# EAGLE design FanDriver (EAGLE 7.1.0)
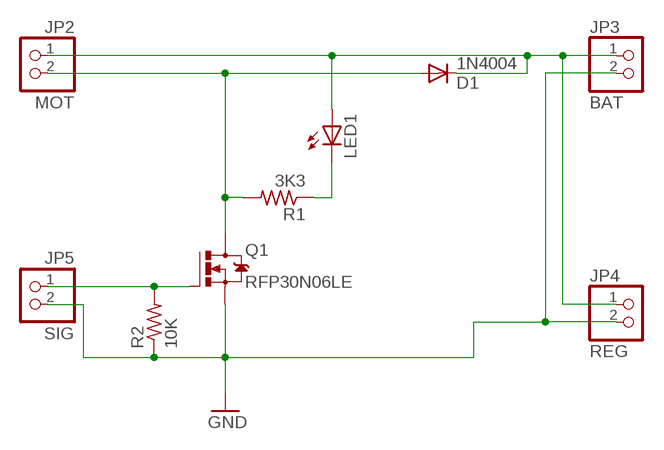
[diagram p0: schematic, sheet 1]

## Parts
D1  1N4004  [DO41-10]
JP2  MOT  PINHD-1X02_2.54-S  [1X02-S]
JP3  BAT  PINHD-1X02_2.54-S  [1X02-S]
JP4  REG  PINHD-1X02_2.54-S  [1X02-S]
JP5  SIG  PINHD-1X02_2.54-S  [1X02-S]
LED1  LEDCHIPLED_1206  [CHIPLED_1206]
Q1  RFP30N06LE  MOSFET-NBV  [TO220BV]
R1  3K3  R-US_R0603  [R0603]
R2  10K  R-US_R0603  [R0603]

## Nets
GND: JP3.2 JP4.2 JP5.2 Q1.S R2.1
M2: D1.A JP2.2 Q1.D R1.2
N$1: LED1.C R1.1
SIG: JP5.1 Q1.G R2.2
VBAT: D1.C JP2.1 JP3.1 JP4.1 LED1.A

## Library data of the parts
D1 = diode:1N4004: DIODE general purpose rectifier, 1 A
JP2-JP5 = pinhead-2:PINHD-1X02: PIN HEADER
LED1 = bt_opto:LED: LED Various packages
Q1 = ads4:MOSFET-N: N-Channel MOSFET
R1 R2 = rcl:R-US_: RESISTOR, American symbol

## Board
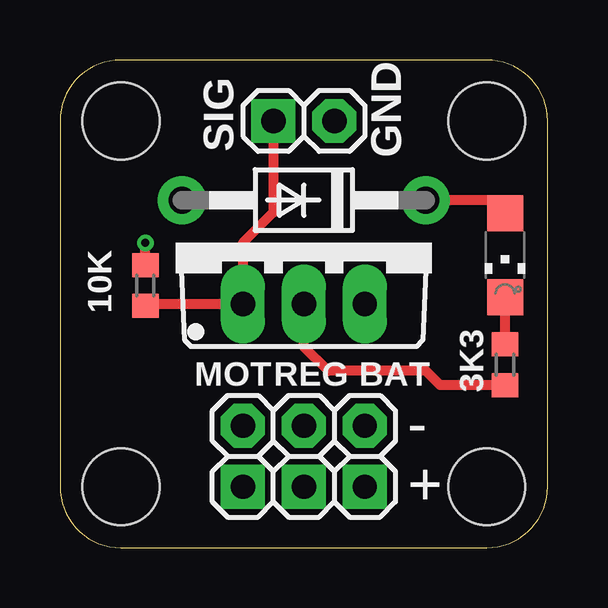
[diagram p1: board, top side]
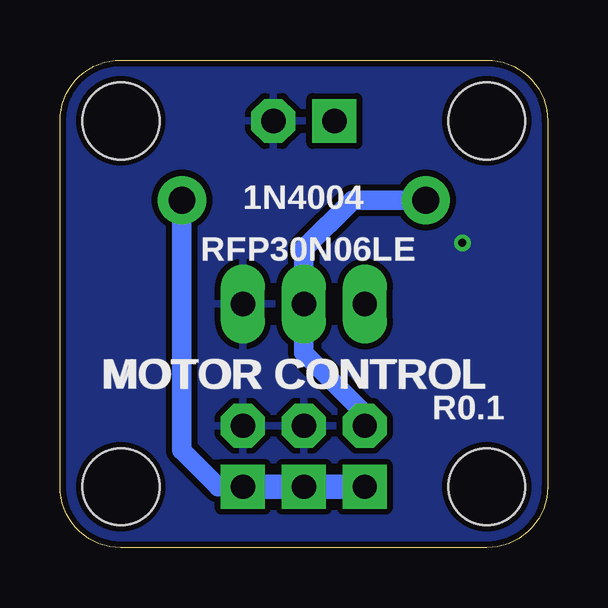
[diagram p2: board, bottom side, seen from below]

Size 20.32 x 20.32 mm. Coordinates in mm from the lower left corner, seen from the top.
Outline: 0,17.78 0,2.54 arc90 2.54,0 17.78,0 arc90 20.32,2.54 20.32,17.78 arc90 17.78,20.32 2.54,20.32 arc90 0,17.78
Copper layers (1*16): Top 0.0356mm / dielectric 1.5011mm / Bottom 0.0356mm
Design rules "LaenPCBOrder *": minimum track width 6mil, minimum drill 13mil, track to track 10mil, track to pad 10mil, pad to pad 10mil, via to via 10mil, smd to smd 8mil, copper to edge 10mil, drill to drill 10mil, minimum pad ring 7mil, minimum via ring 7mil, stop-mask expansion 3mil, vias tented up to drill 20mil, thermal gap 10mil
Holes 3.2 mm at 2.54,2.54 17.78,2.54 2.54,17.78 17.78,17.78

### Footprints (pad centres in the part's own frame; a part is rotated, then mirrored left to right if it is on the bottom)
DO41-10 = drill 1.118: A 5.08,0; C -5.08,0
1X02-S = drill 1.016 square: 1 -1.27,0 | drill 1.016 octagon: 2 1.27,0
CHIPLED_1206 = smd 1.5 x 1.5: A 0,-1.75; C 0,1.75
TO220BV = drill 1.016 long: D 0,0; G -2.54,0; S 2.54,0
R0603 = smd 1 x 1.1: 1 -0.85,0; 2 0.85,0

### Placement (x,y rotation side)
D1  10.16,14.48 180 top
JP2  7.62,3.81 90 top
JP3  12.7,3.81 90 top
JP4  10.16,3.81 90 top
JP5  10.16,17.78 0 top
LED1  18.54,12.19 180 top
Q1  10.16,10.16 0 top
R1  18.54,7.62 270 top
R2  3.56,10.92 270 top

### Tracks (layer width: path | path; a pad name or v marks a point on that pad's centre or on a via)
GND  (via drill 0.33)
  Top 0.406: R2.1 v3.56,12.7
  pour Bottom: 2.54,20.32 17.78,20.32 arc-90 20.32,17.78 20.32,2.54 arc-90 17.78,0 2.54,0 arc-90 0,2.54 0,17.78 arc-90
M2
  Top 0.406: R1.2 15.84,6.77 15.24,7.37 11.18,7.37 10.16,8.38 Q1.D
  Bottom 0.813: D1.A 8.13,14.48 10.16,12.45 Q1.D 10.16,8.13 7.62,5.59 JP2.2
N$1
  Top 0.406: R1.1 LED1.C
SIG
  Top 0.406: JP5.1 8.89,13.97 7.62,12.7 Q1.G 3.81,10.16 3.64,10.07 R2.2
VBAT
  Top 0.406: LED1.A 18.54,14.22 18.29,14.48 D1.C
  Bottom 0.813: JP3.1 13.72,2.54 15.24,4.06 D1.C
  Bottom 1.016: JP3.1 JP4.1 JP2.1

### Text on the board
tNames: GND | - | +
bNames: MOTOR CONTROL | R0.1
tsilk: SIG | GND | 10K | MOT | REG | BAT | 3K3 | - | +
bsilk: 1N4004 | RFP30N06LE | MOTOR CONTROL | R0.1